# EasyEDA Pro project R7FA2E1A7_COG12864.eprj

# Schematic Schematic1
Create Date: 2023-08-11; Page Name: P1; Project Name: R7FA2E1A7_COG12864; Schematic Name: Schematic1; Update Date: 2023-09-12; Company: 嘉立创EDA; Page Size: A4; Version: V1.0
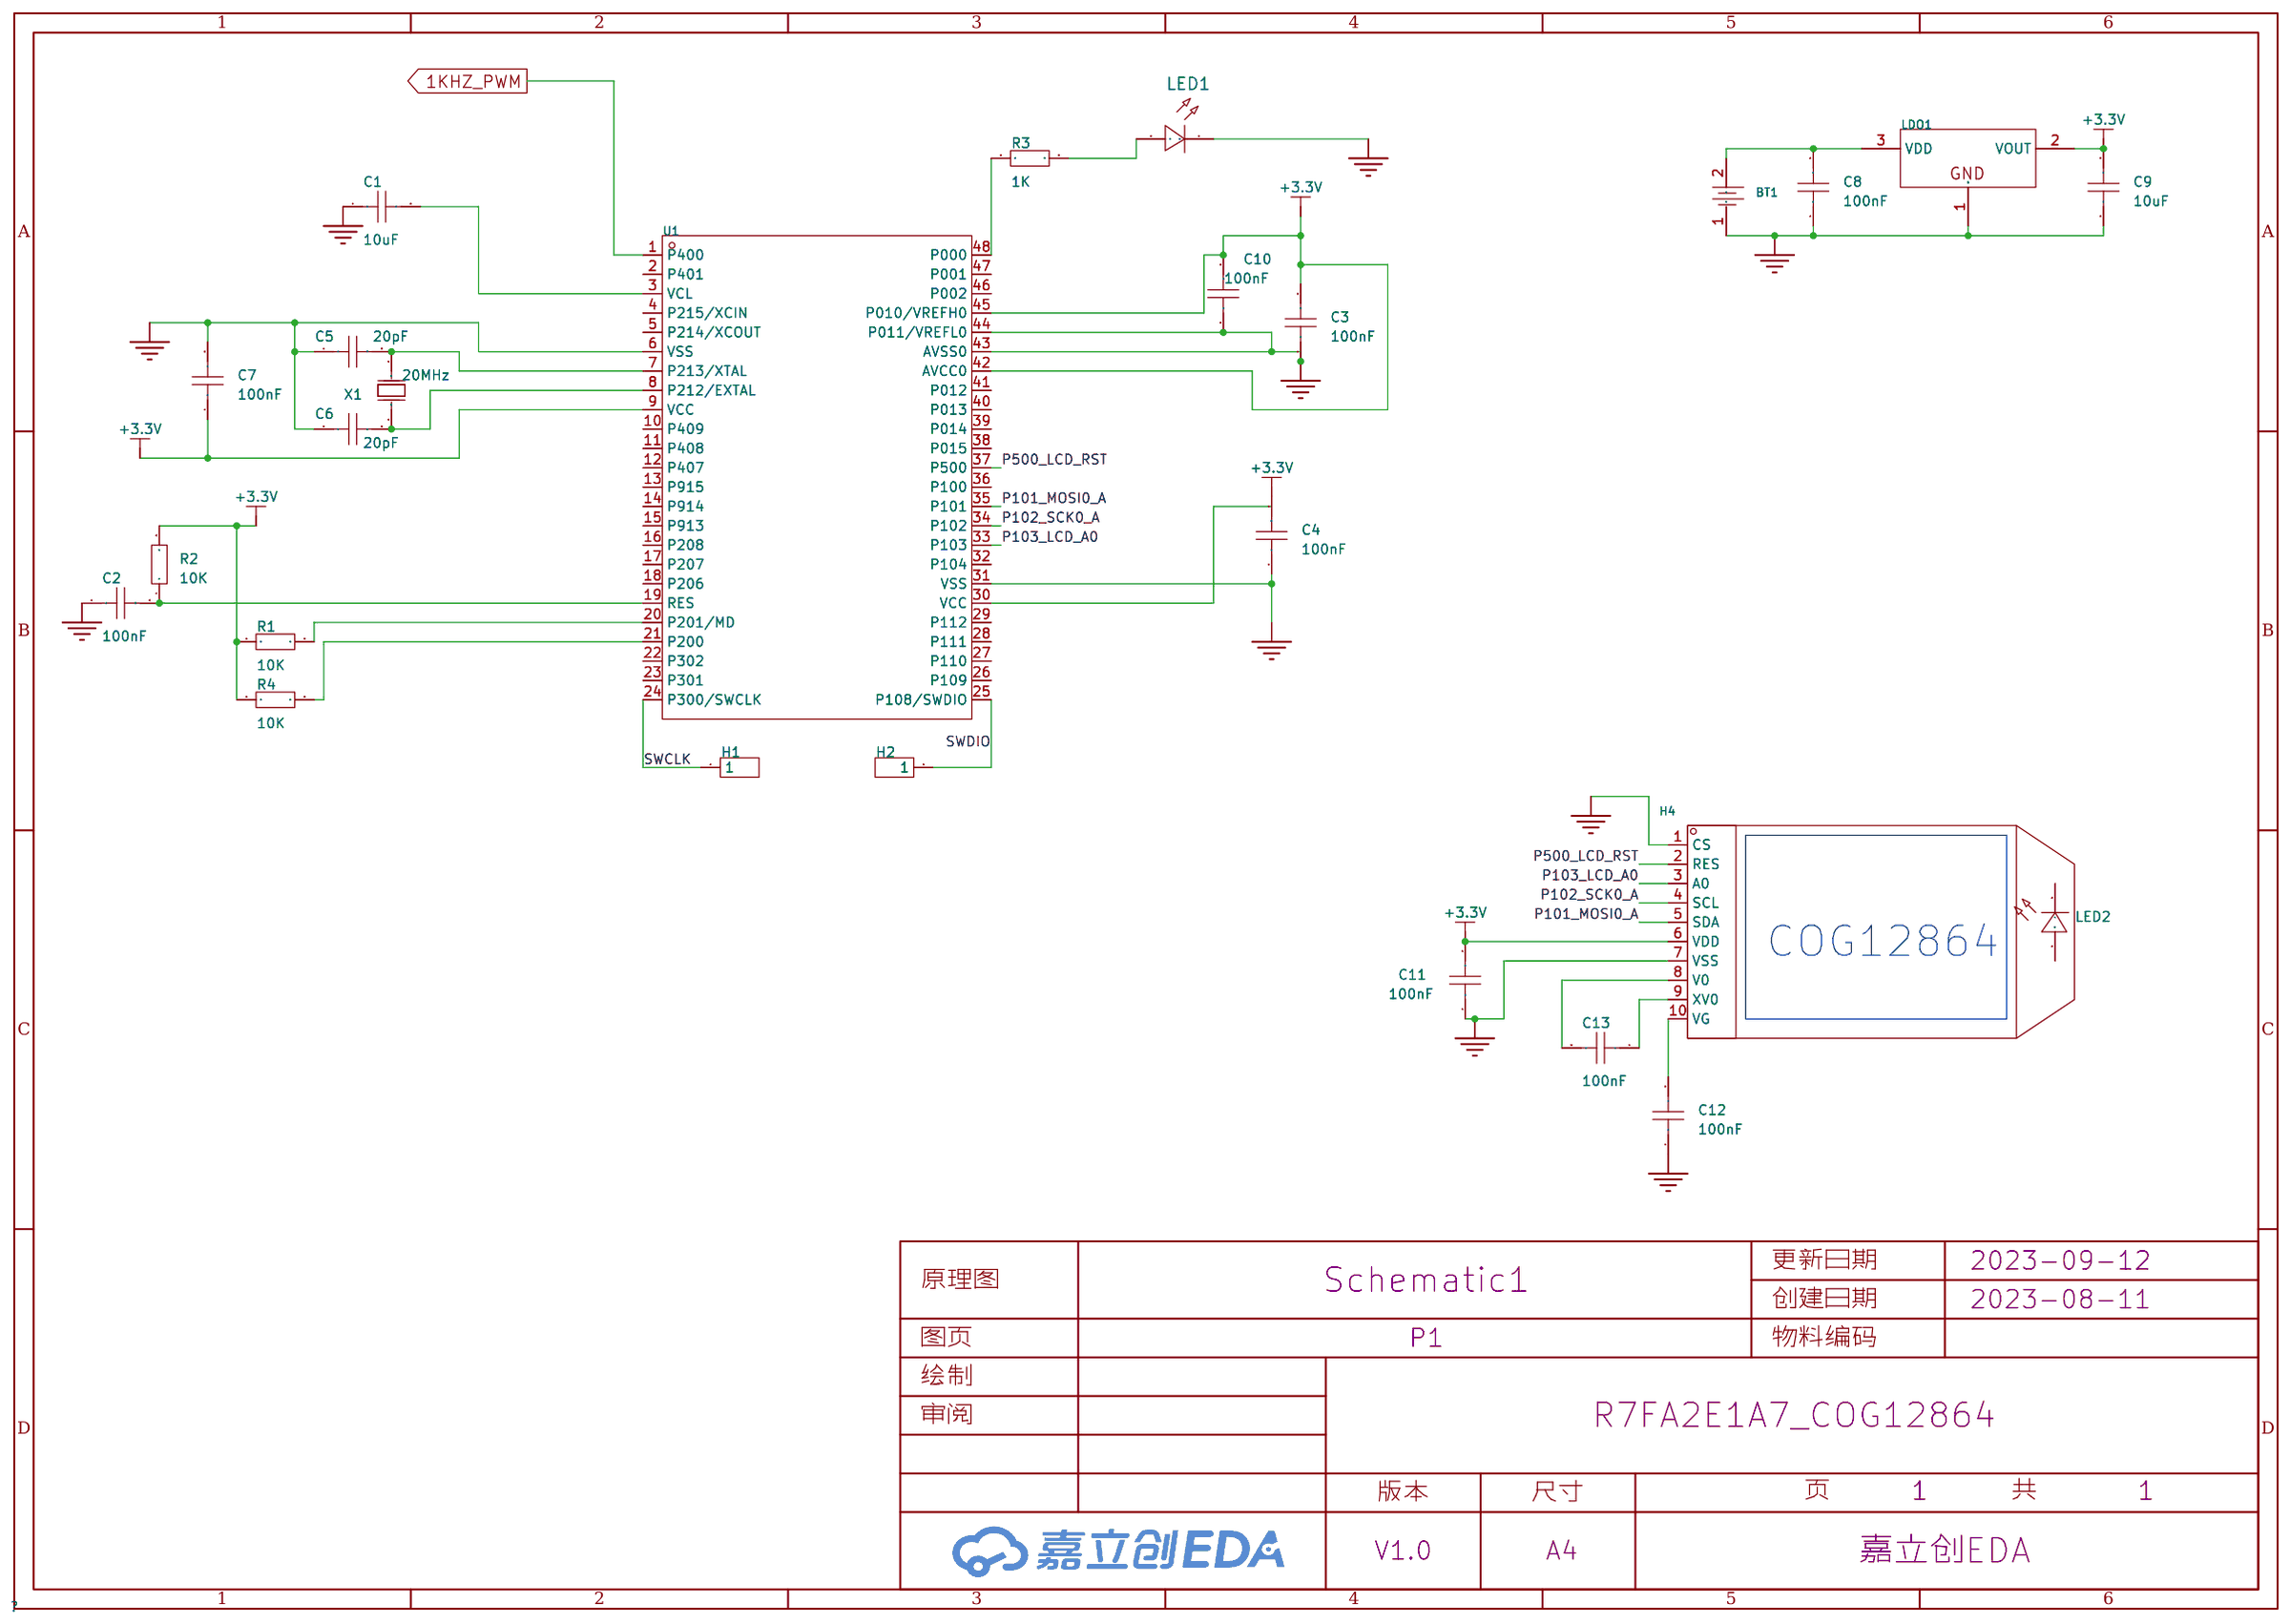
[diagram p0: schematic sheet]

## Parts
BT1  BH-18650-B1BA002  [BATTERY-SMD_18650-1S-L77.1-W20.7-1]
C1  10uF  [C0603]
C2  100nF  [C0603]
C3  100nF  [C0603]
C4  100nF  [C0603]
C5  20pF  [C0603]
C6  20pF  [C0603]
C7  100nF  [C0603]
C8  100nF  [C0603]
C9  10uF  [C0603]
C10  100nF  [C0603]
C11  100nF  [C0603]
C12  100nF  [C0603]
C13  100nF  [C0603]
H1  -  [HDR-TH_1P-V-M_XKB_X4611WV-01I-C28D40]
H2  -  [HDR-TH_1P-V-M_XKB_X4611WV-01I-C28D40]
H4  -  [HDR-TH_10P-P2.54-V-M-1]
LDO1  SC662K-3.3V  [SOT-23-3_L2.9-W1.3-P1.90-LS2.4-BR]
LED1  -  [LED_0603]
LED2  -  [LED_TH-3mm]
R1  10K  [R0603]
R2  10K  [R0603]
R3  1K  [R0603]
R4  10K  [R0603]
U1  R7FA2E1A72DFL#AA0  [LQFP-48_L7.0-W7.0-P0.50-LS9.0-BL]
X1  20MHz  [OSC-TH_L10.0-W4.5-P5.00]

## Library data of the parts
BT1 = BH-18650-B1BA002: 连接器类型:电池盒;适用电池规格:18650;; LCSC Part Name: 电池盒 适用电池:18650; Supplier Part: C2988620; Manufacturer: MYOUNG(美阳); Supplier Footprint: SMD; JLCPCB Part Class: Extended Part; Datasheet: https://atta.szlcsc.com/upload/public/pdf/source/20220402/870DB99AB50CA0DF8D51CF7C86A51FAB.pdf; Supplier: LCSC; Connector Type: 电池盒; Battery Type: 18650
C1-C13 = CAP_0603: Supplier Footprint: 0603
H1 H2 = HDR-M_2.54_1x1P: Supplier Part: C81276; Supplier Footprint: 插件; JLCPCB Part Class: Extended Part
H4 = HDR-M_2.54_1x10P: Supplier Part: C57369; Supplier Footprint: 插件; Supplier: LCSC; Manufacturer Part: 2.54-1*10P针; JLCPCB Part Class: Extended Part; Manufacturer: BOOMELE(博穆精密)
LDO1 = SC662K-3.3V: 输出类型:固定;输出极性:正;最大输入电压:6V;输出电压:3.3V;输出电流:250mA;电源纹波抑制比(PSRR):50dB@(1kHz);; LCSC Part Name: 输入6V 输出3.3V 250mA 停产; Supplier Part: C83932; Manufacturer: FM(富满); Supplier Footprint: SOT-23; JLCPCB Part Class: Extended Part; Datasheet: https://atta.szlcsc.com/upload/public/pdf/source/20161024/1477288576049.pdf; Supplier: LCSC; Output Type: 固定; Output Polarity: 正; Number of Outputs: 1; Maximum Input Voltage: 6V; Output Voltage: 3.3V; Dropout Voltage: 38mV@(10mA); Output Current: 250mA; Power Supply Rejection Ratio (PSRR): 50dB@(1kHz)
LED1 = LED_0603-R: Supplier Footprint: 0603
LED2 = LED_TH-R_3mm: Supplier Footprint: 插件
R1-R4 = Res_0603: Supplier Footprint: 0603
U1 = R7FA2E1A72DFL#AA0: CPU内核:ARM Cortex-M23;CPU最大主频:48MHz;工作电压范围:1.6V~5.5V;程序存储容量:64KB;RAM总容量:16KB;GPIO端口数量:40;; Supplier Part: C2932201; Manufacturer: RENESAS(瑞萨)/IDT; Supplier Footprint: LQFP-48(7x7); JLCPCB Part Class: Extended Part; Datasheet: https://atta.szlcsc.com/upload/public/pdf/source/20211215/29BE301818A18D7F99D1A8CE53F7A919.pdf; Supplier: LCSC; CPU Core: ARM Cortex-M23; CPU Maximum Speed: 48MHz; Operating Voltage Range: 1.6V~5.5V; Program Storage Size: 64KB; RAM Size: 16KB; EEPROM: 4KB; GPIO Ports Number: 40; ADC (Bit): 12bit; Peripheral/Function: 触摸按键；安全加密; communication protocol: 以太网协议; Watchdog: 有; Real-Time Clock: 有; Low-Voltage Detect: 有; Direct Memory Access: 有; Operating Temperature Range: -40℃~+85℃
X1 = X49SD20MPB2SC: 频率:20MHz;频率公差:±10ppm;负载电容:15pF;; LCSC Part Name: 20MHz ±10ppm 15pF HC-49US; Supplier Part: C21499; Manufacturer: YXC(扬兴晶振); Supplier Footprint: HC-49S; JLCPCB Part Class: Extended Part; Datasheet: https://atta.szlcsc.com/upload/public/pdf/source/20210903/A997D130AE99CBB55D9024F9BE6DA174.pdf; Supplier: LCSC; Crystal Type: 49S晶振; Frequency Tolerance: ±10ppm; Frequency Stability: ±30ppm; Load Capacitance: 15pF; Operating Temperature: -20℃~+70℃

## Nets
+3.3V: C3.2 C4.2 C7.1 C9.2 C10.2 C11.2 H4.6(VDD) LDO1.2(VOUT) R1.1 R2.2 R4.1 U1.9(VCC) U1.42(AVCC0) U1.45(P010/VREFH0)
GND: BT1.1 C1.1 C2.1 C3.1 C4.1 C5.1 C6.1 C7.2 C8.1 C9.1 C10.1 C11.1 C12.1 H4.1(CS) H4.7(VSS) LDO1.1(GND) LED1.1(C) U1.6(VSS) U1.31(VSS) U1.43(AVSS0) U1.44(P011/VREFL0)
1KHZ_PWM: U1.1(P400)
P101_MOSI0_A: H4.5(SDA) U1.35(P101)
P102_SCK0_A: H4.4(SCL) U1.34(P102)
P103_LCD_A0: H4.3(A0) U1.33(P103)
P500_LCD_RST: H4.2(RES) U1.37(P500)
SWCLK: H1.1 U1.24(P300/SWCLK)
SWDIO: H2.1 U1.25(P108/SWDIO)
Net-(BT1-2): BT1.2 C8.2 LDO1.3(VDD)
Net-(C1-2): C1.2 U1.3(VCL)
Net-(C2-2): C2.2 R2.1 U1.19(RES)
Net-(C5-2): C5.2 U1.7(P213/XTAL) X1.1(OSC1)
Net-(C6-2): C6.2 U1.8(P212/EXTAL) X1.2(OSC2)
Net-(C12-2): C12.2 H4.10(VG)
Net-(C13-1): C13.1 H4.9(XV0)
Net-(C13-2): C13.2 H4.8(V0)
Net-(LED1-2): LED1.2(A) R3.2
Net-(R1-2): R1.2 U1.20(P201/MD)
Net-(R3-1): R3.1 U1.48(P000)
Net-(R4-2): R4.2 U1.21(P200)

Not connected (* = marked no-connect by the designer): LED2 1(C) 2(A); U1 2(P401) 4(P215/XCIN) 5(P214/XCOUT) 10(P409) 11(P408) 12(P407) 13(P915) 14(P914) 15(P913) 16(P208) 17(P207) 18(P206) 22(P302) 23(P301) 26(P109) 27(P110) 28(P111) 29(P112) 30(VCC) 32(P104) 36(P100) 38(P015) 39(P014) 40(P013) 41(P012) 46(P002) 47(P001)

## Notes on the sheet
- COG12864
